# EAGLE design blank_petal (EAGLE 7.5.0)
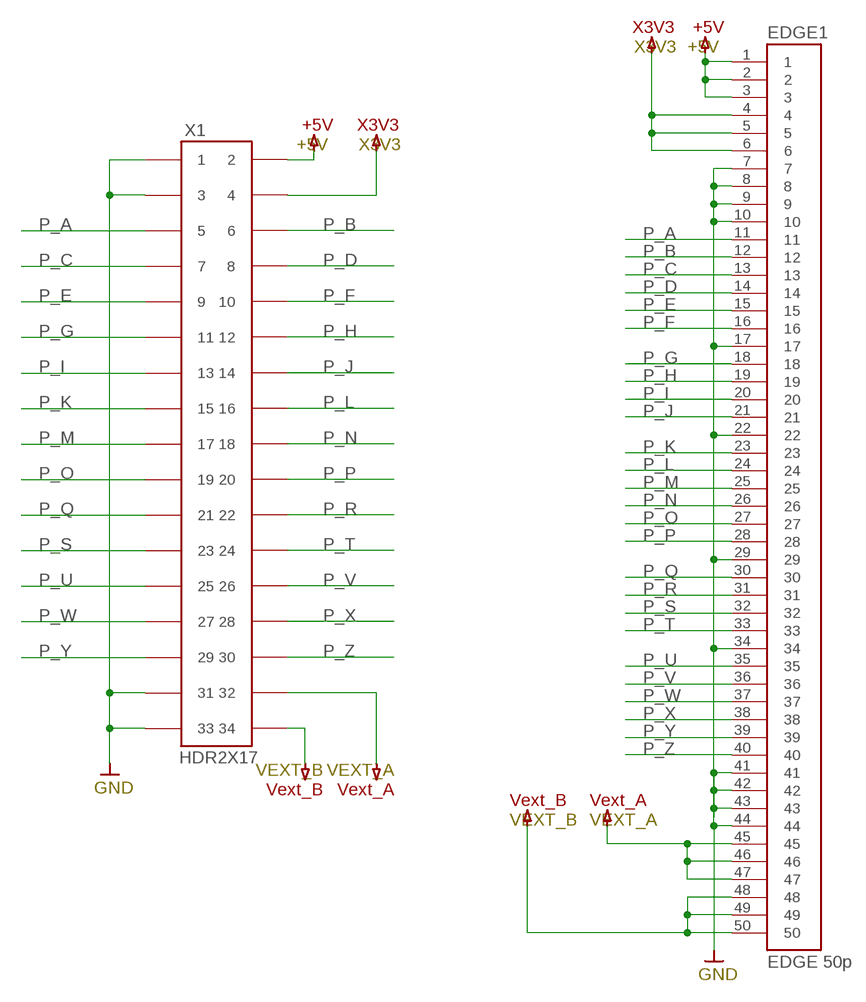
[diagram p0: schematic, sheet 1]

## Parts
EDGE1  EDGE 50p  PCB_EDGE_CONNECTOR  [MB1-150-01-XX-S-XX-SL-CARD]
X1  HDR2X17  HDR2X17-M-VERT  [2X17-MALE]

## Nets
+5V: EDGE1.1 EDGE1.2 EDGE1.3 X1.2
GND: EDGE1.7 EDGE1.8 EDGE1.9 EDGE1.10 EDGE1.17 EDGE1.22 EDGE1.29 EDGE1.34 EDGE1.41 EDGE1.42 EDGE1.43 EDGE1.44 X1.1 X1.3 X1.31 X1.33
P_A: EDGE1.11 X1.5
P_B: EDGE1.12 X1.6
P_C: EDGE1.13 X1.7
P_D: EDGE1.14 X1.8
P_E: EDGE1.15 X1.9
P_F: EDGE1.16 X1.10
P_G: EDGE1.18 X1.11
P_H: EDGE1.19 X1.12
P_I: EDGE1.20 X1.13
P_J: EDGE1.21 X1.14
P_K: EDGE1.23 X1.15
P_L: EDGE1.24 X1.16
P_M: EDGE1.25 X1.17
P_N: EDGE1.26 X1.18
P_O: EDGE1.27 X1.19
P_P: EDGE1.28 X1.20
P_Q: EDGE1.30 X1.21
P_R: EDGE1.31 X1.22
P_S: EDGE1.32 X1.23
P_T: EDGE1.33 X1.24
P_U: EDGE1.35 X1.25
P_V: EDGE1.36 X1.26
P_W: EDGE1.37 X1.27
P_X: EDGE1.38 X1.28
P_Y: EDGE1.39 X1.29
P_Z: EDGE1.40 X1.30
VEXT_A: EDGE1.45 EDGE1.46 EDGE1.47 X1.32
VEXT_B: EDGE1.48 EDGE1.49 EDGE1.50 X1.34
X3V3: EDGE1.4 EDGE1.5 EDGE1.6 X1.4

## Library data of the parts
EDGE1 = Cynara-Connectors:PCB_EDGE_CONNECTOR: PCB EDGE CONNECTOR mating with SAMTEC 1MM MINI-CARD GUIDE MB1 series: MB1-150-01-F-S-02-SL
X1 = Cynara-Connectors:HDR2X17-M; MANUFACTURER: WURTH; MANUFACTURERPARTNO: 61303421121

## Board
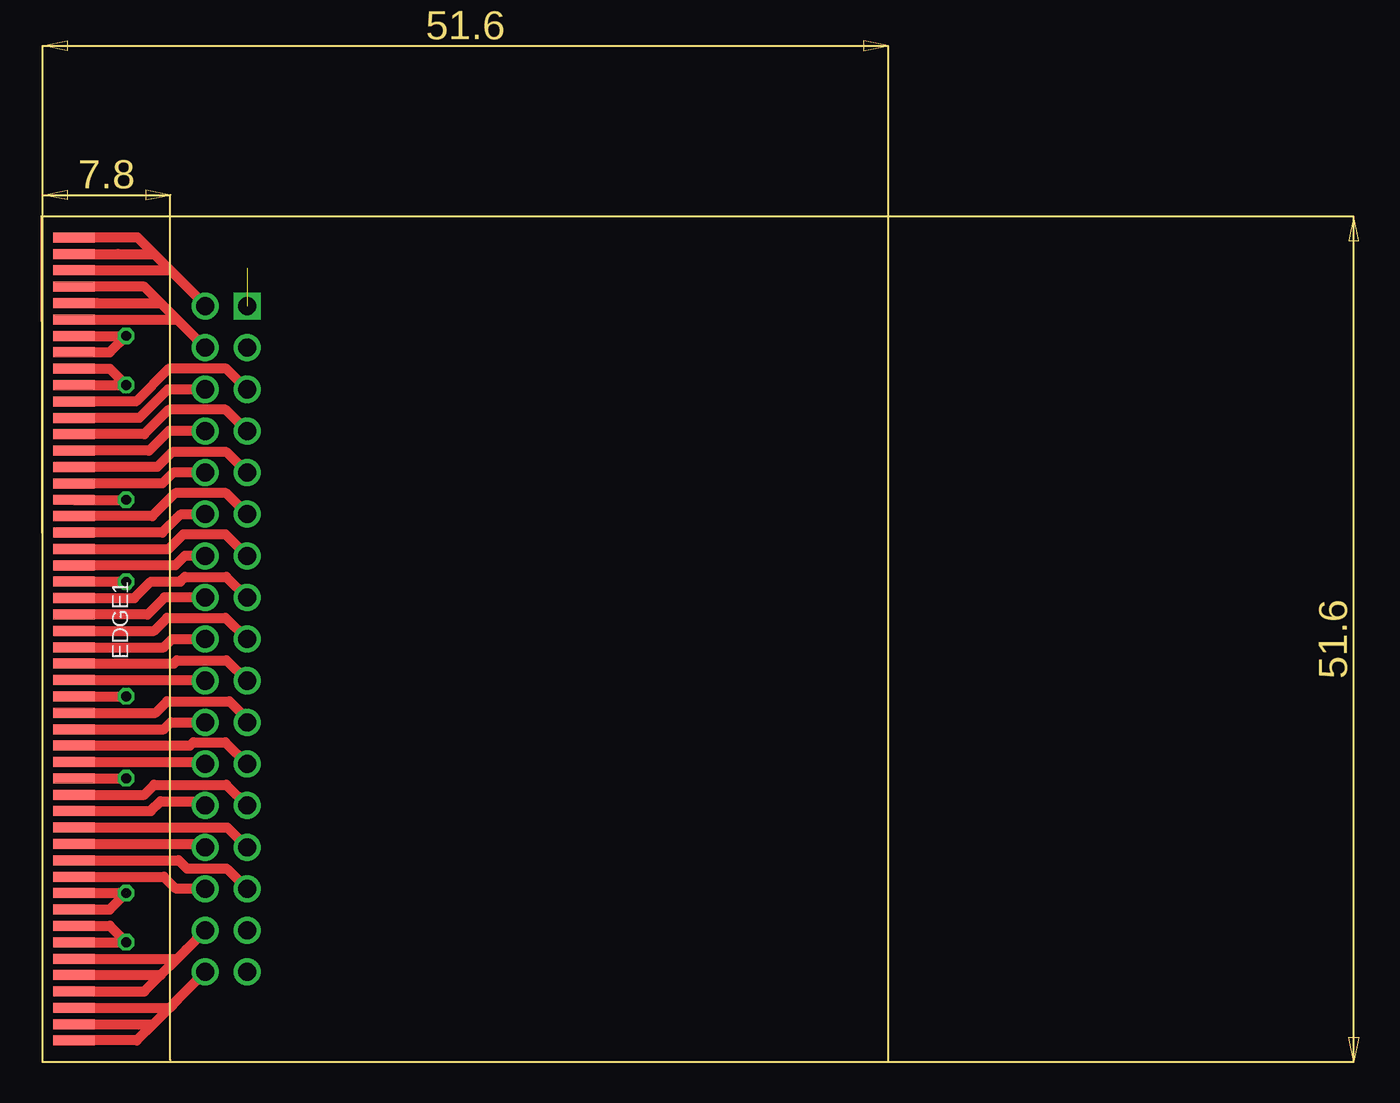
[diagram p1: board, top side]
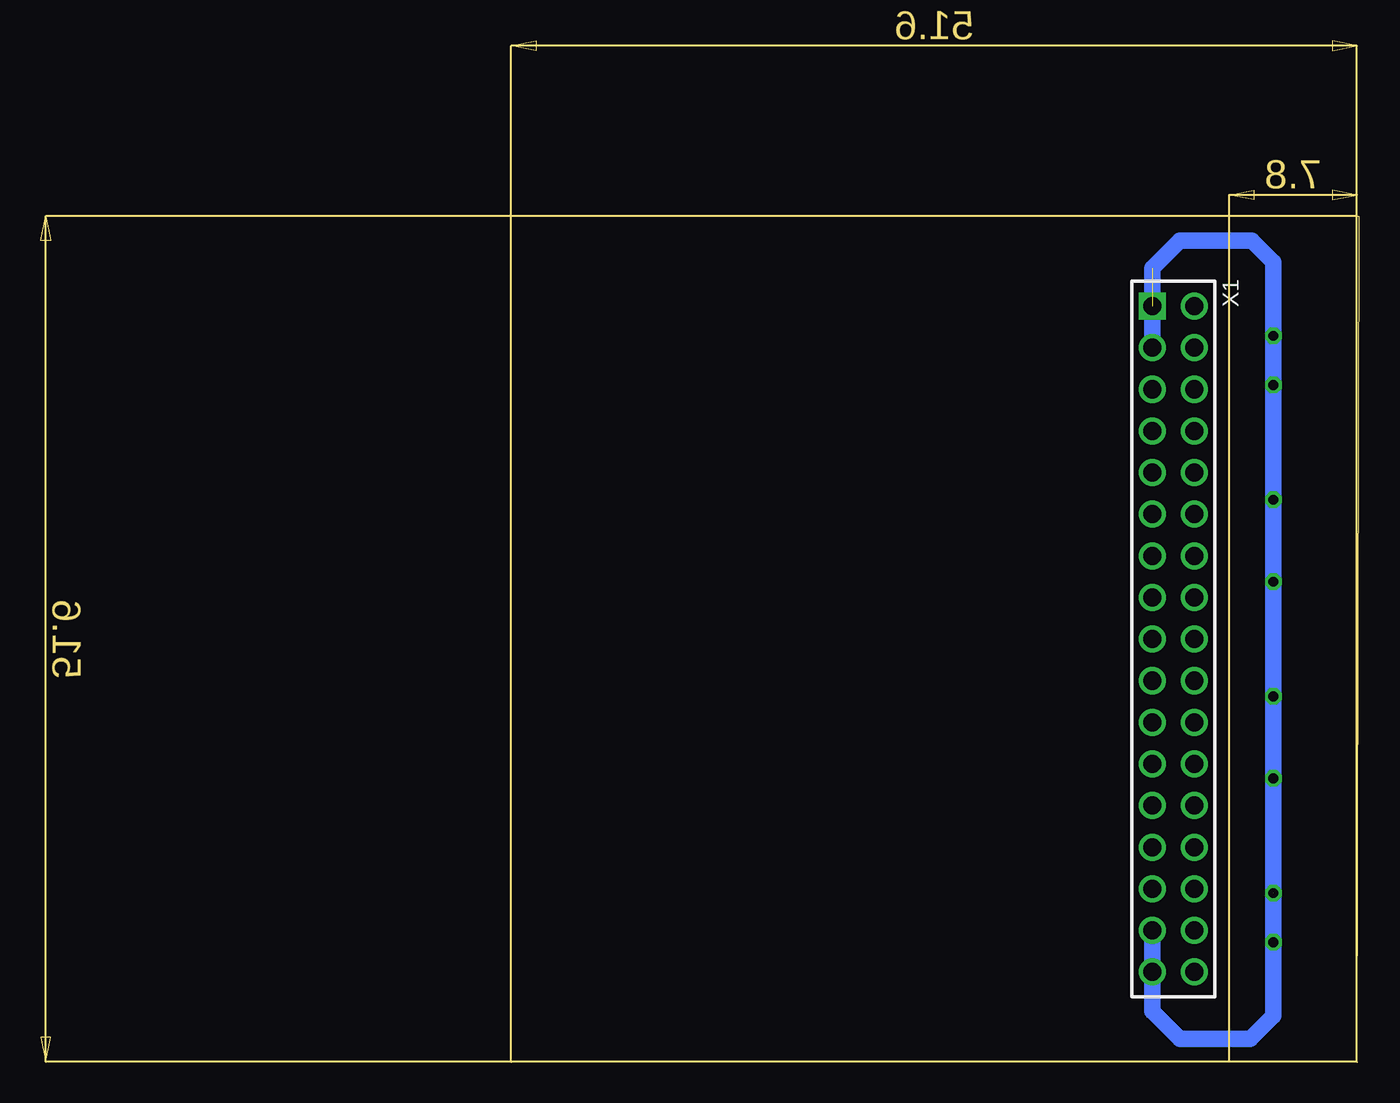
[diagram p2: board, bottom side, seen from below]

Size 51.7 x 51.6 mm. Coordinates in mm from the lower left corner, seen from the top.
Outline: 0.1,0 51.7,0 51.7,51.6 0,51.6 0.1,0
Copper layers (1*16): Top 0.035mm / dielectric 1.5mm / Bottom 0.035mm
Design rules "default": minimum track width 10mil, minimum drill 0.6mm, track to track 8mil, track to pad 8mil, pad to pad 8mil, via to via 8mil, smd to smd 8mil, copper to edge 40mil, drill to drill 8mil, minimum pad ring 10mil, minimum via ring 8mil, stop-mask expansion 4mil, vias tented up to drill 0mil, thermal gap 10mil

### Footprints (pad centres in the part's own frame; a part is rotated, then mirrored left to right if it is on the bottom)
MB1-150-01-XX-S-XX-SL-CARD = smd 0.61 x 2.54: 1 -24.5,1.905; 2 -23.5,1.905; 3 -22.5,1.905; 4 -21.5,1.905; 5 -20.5,1.905; 6 -19.5,1.905; 7 -18.5,1.905; 8 -17.5,1.905; 9 -16.5,1.905; 10 -15.5,1.905; 11 -14.5,1.905; 12 -13.5,1.905; 13 -12.5,1.905; 14 -11.5,1.905; 15 -10.5,1.905; 16 -9.5,1.905; 17 -8.5,1.905; 18 -7.5,1.905; 19 -6.5,1.905; 20 -5.5,1.905; 21 -4.5,1.905; 22 -3.5,1.905; 23 -2.5,1.905; 24 -1.5,1.905; 25 -0.5,1.905; 26 0.5,1.905; 27 1.5,1.905; 28 2.5,1.905; 29 3.5,1.905; 30 4.5,1.905; 31 5.5,1.905; 32 6.5,1.905; 33 7.5,1.905; 34 8.5,1.905; 35 9.5,1.905; 36 10.5,1.905; 37 11.5,1.905; 38 12.5,1.905; 39 13.5,1.905; 40 14.5,1.905; 41 15.5,1.905; 42 16.5,1.905; 43 17.5,1.905; 44 18.5,1.905; 45 19.5,1.905; 46 20.5,1.905; 47 21.5,1.905; 48 22.5,1.905; 49 23.5,1.905; 50 24.5,1.905
2X17-MALE = drill 1.1 square: 1 -20.32,-1.27 | drill 1.1: 2 -20.32,1.27; 3 -17.78,-1.27; 4 -17.78,1.27; 5 -15.24,-1.27; 6 -15.24,1.27; 7 -12.7,-1.27; 8 -12.7,1.27; 9 -10.16,-1.27; 10 -10.16,1.27; 11 -7.62,-1.27; 12 -7.62,1.27; 13 -5.08,-1.27; 14 -5.08,1.27; 15 -2.54,-1.27; 16 -2.54,1.27; 17 0,-1.27; 18 0,1.27; 19 2.54,-1.27; 20 2.54,1.27; 21 5.08,-1.27; 22 5.08,1.27; 23 7.62,-1.27; 24 7.62,1.27; 25 10.16,-1.27; 26 10.16,1.27; 27 12.7,-1.27; 28 12.7,1.27; 29 15.24,-1.27; 30 15.24,1.27; 31 17.78,-1.27; 32 17.78,1.27; 33 20.32,-1.27; 34 20.32,1.27

### Placement (x,y rotation side)
EDGE1  0.1,25.8 270 top
X1  11.3,25.8 270 bottom

### Tracks (layer width: path | path; a pad name or v marks a point on that pad's centre or on a via)
+5V
  Top 0.6: EDGE1.3 7.9,48.3 | 4.7,49.3 EDGE1.2 6.9,49.3 | X1.2 10.03,46.17 7.9,48.3 | 7.9,48.3 6.9,49.3 | 6.9,49.3 5.9,50.3 EDGE1.1
GND  (via drill 0.6)  (2 unrouted)
  Top 0.6: EDGE1.7 v5.2,44.3 4.2,43.3 EDGE1.8 | EDGE1.10 v5.2,41.3 | 3.5,42.3 EDGE1.9 4.2,42.3 v5.2,41.3 | 4.5,41.3 v5.2,41.3 | EDGE1.17 v5.2,34.3 | EDGE1.22 v5.2,29.3 | EDGE1.41 v5.2,10.3 4.2,9.3 EDGE1.42 | EDGE1.44 v5.2,7.3 | v5.2,7.3 | EDGE1.43 4.2,8.3 v5.2,7.3 | EDGE1.34 v5.2,17.3 | v5.2,17.3 | EDGE1.29 v5.2,22.3
  Bottom 1: X1.3 12.57,48.43 10.9,50.1 6.5,50.1 5.2,48.8 v5.2,44.3 v5.2,41.3 v5.2,34.3 v5.2,29.3 v5.2,22.3 v5.2,17.3 v5.2,10.3 v5.2,7.3 5.2,2.8 6.6,1.4 10.9,1.4 12.57,3.07 X1.33 X1.31
P_A
  Top 0.6: X1.5 11.31,42.3 7.8,42.3 5.8,40.3 EDGE1.11
P_B
  Top 0.6: X1.6 7.74,41.04 6,39.3 EDGE1.12
P_C
  Top 0.6: X1.7 11.27,39.8 7.8,39.8 6.3,38.3 EDGE1.13
P_D
  Top 0.6: X1.8 7.8,38.5 6.6,37.3 EDGE1.14
P_E
  Top 0.6: X1.9 11.33,37.2 8,37.2 7.1,36.3 EDGE1.15
P_F
  Top 0.6: X1.10 8.06,35.96 7.4,35.3 EDGE1.16
P_G
  Top 0.6: X1.11 11.29,34.7 8.2,34.7 6.8,33.3 EDGE1.18
P_H
  Top 0.6: X1.12 10.01,33.4 8.5,33.4 7.4,32.3 EDGE1.19
P_I
  Top 0.6: EDGE1.20 7.8,31.3 8.7,32.2 11.25,32.2 X1.13
P_J
  Top 0.6: X1.14 8.78,30.88 8.2,30.3 EDGE1.21
P_K
  Top 0.6: EDGE1.23 5.7,28.3 6.7,29.3 8.5,29.3 8.8,29.6 11.31,29.6 X1.15
P_L
  Top 0.6: X1.16 7.54,28.34 6.5,27.3 EDGE1.24
P_M
  Top 0.6: EDGE1.25 6.9,26.3 7.7,27.1 11.27,27.1 X1.17
P_N
  Top 0.6: EDGE1.26 7.5,25.3 8,25.8 X1.18
P_O
  Top 0.6: EDGE1.27 8.1,24.3 8.3,24.5 11.33,24.5 X1.19
P_P
  Top 0.6: EDGE1.28 9.99,23.3 X1.20
P_Q
  Top 0.6: EDGE1.30 7,21.3 7.7,22 11.5,22 12.57,20.93 X1.21
P_R
  Top 0.6: EDGE1.31 7.5,20.3 7.92,20.72 X1.22
P_S
  Top 0.6: EDGE1.32 9.1,19.3 9.3,19.5 11.25,19.5 X1.23
P_T
  Top 0.6: EDGE1.33 9.91,18.3 X1.24
P_U
  Top 0.6: EDGE1.35 6.3,16.3 6.9,16.9 11.31,16.9 X1.25
P_V
  Top 0.6: EDGE1.36 6.7,15.3 7.3,15.9 9.77,15.9 X1.26
P_W
  Top 0.6: EDGE1.37 11.37,14.3 X1.27
P_X
  Top 0.6: EDGE1.38 9.83,13.3 X1.28
P_Y
  Top 0.6: EDGE1.39 8.4,12.3 8.9,11.8 11.33,11.8 X1.29
P_Z
  Top 0.6: EDGE1.40 7.5,11.3 8.2,10.6 9.99,10.6 X1.30
VEXT_A
  Top 0.6: EDGE1.47 6.31,4.3 7.31,5.3 | 7.31,5.3 8.31,6.3 | X1.32 8.86,6.84 8.31,6.3 | EDGE1.46 7.31,5.3 | EDGE1.45 8.31,6.3
VEXT_B
  Top 0.6: X1.34 8.32,3.77 7.85,3.3 | 7.85,3.3 6.85,2.3 | 6.85,2.3 5.85,1.3 EDGE1.50 | EDGE1.49 6.85,2.3 | EDGE1.48 7.85,3.3
X3V3
  Top 0.6: X1.4 8.9,44.7 8.31,45.3 | 8.31,45.3 7.3,46.3 | 7.3,46.3 6.31,47.3 EDGE1.4 | EDGE1.5 3.4,46.3 3.41,46.3 7.3,46.3 | EDGE1.6 8.31,45.3